# Altium schematic sheet Choin_rez1_0.SchDoc
size A4; DocumentNumber: 4; SheetNumber: 4; SheetTotal: 4; LotOfPieces: 1
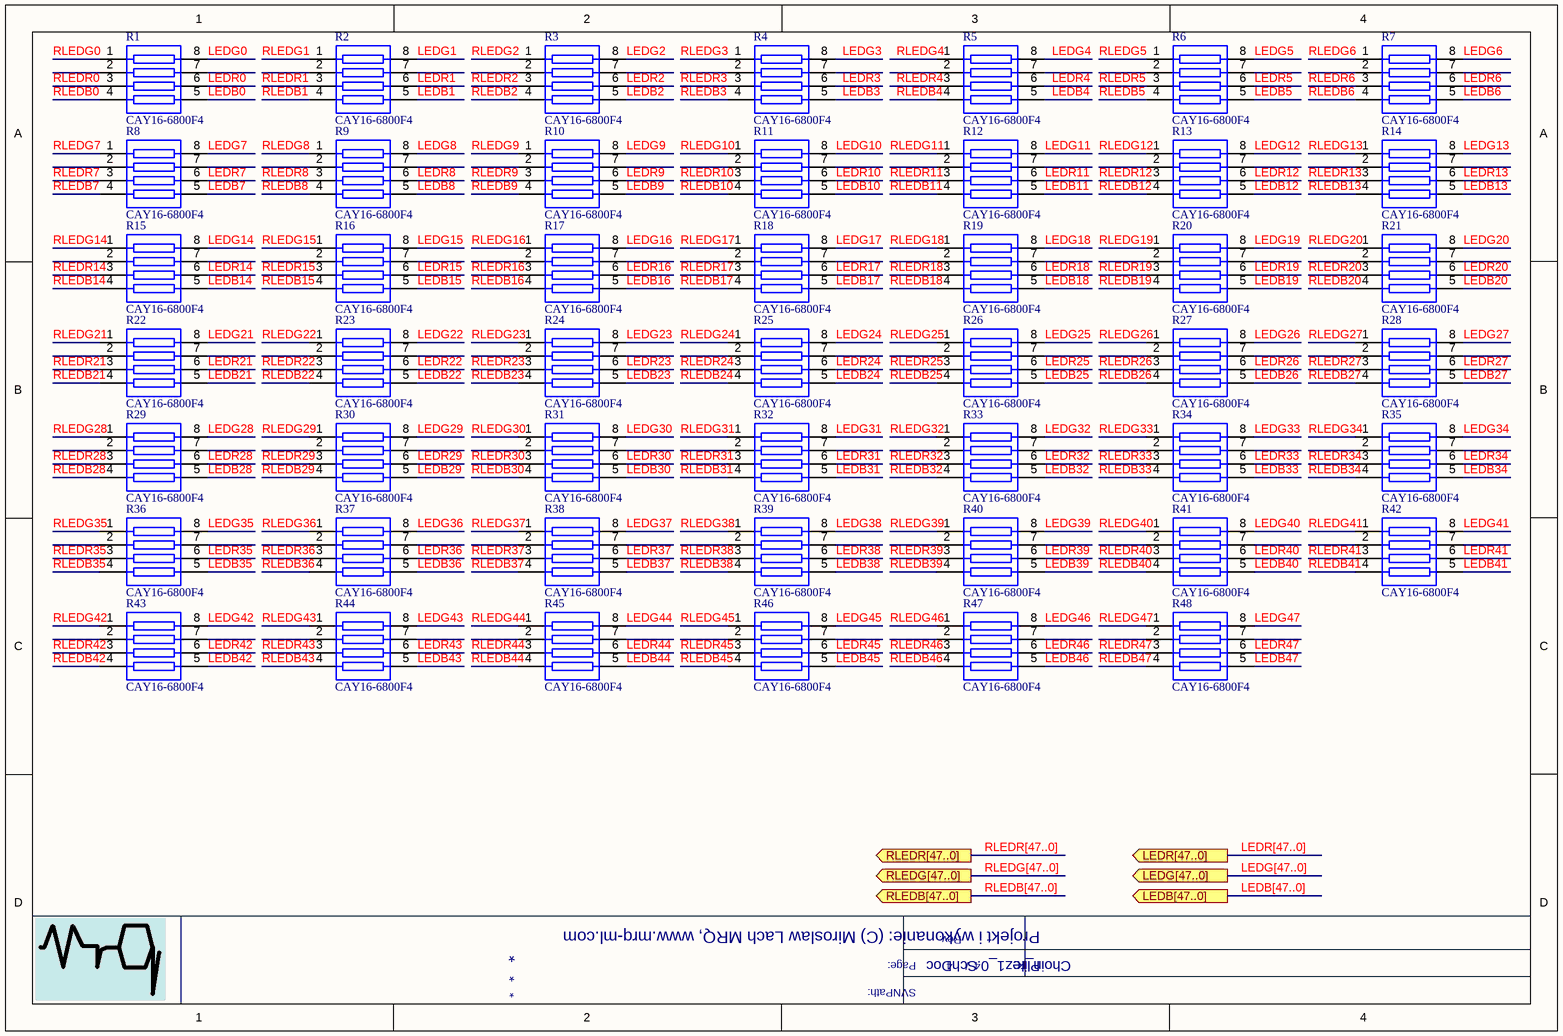
[diagram p0: Choin_rez1_0.SchDoc]

## Parts
R1  CAY16-6800F4  [1206RPS]
R2  CAY16-6800F4  [1206RPS]
R3  CAY16-6800F4  [1206RPS]
R4  CAY16-6800F4  [1206RPS]
R5  CAY16-6800F4  [1206RPS]
R6  CAY16-6800F4  [1206RPS]
R7  CAY16-6800F4  [1206RPS]
R8  CAY16-6800F4  [1206RPS]
R9  CAY16-6800F4  [1206RPS]
R10  CAY16-6800F4  [1206RPS]
R11  CAY16-6800F4  [1206RPS]
R12  CAY16-6800F4  [1206RPS]
R13  CAY16-6800F4  [1206RPS]
R14  CAY16-6800F4  [1206RPS]
R15  CAY16-6800F4  [1206RPS]
R16  CAY16-6800F4  [1206RPS]
R17  CAY16-6800F4  [1206RPS]
R18  CAY16-6800F4  [1206RPS]
R19  CAY16-6800F4  [1206RPS]
R20  CAY16-6800F4  [1206RPS]
R21  CAY16-6800F4  [1206RPS]
R22  CAY16-6800F4  [1206RPS]
R23  CAY16-6800F4  [1206RPS]
R24  CAY16-6800F4  [1206RPS]
R25  CAY16-6800F4  [1206RPS]
R26  CAY16-6800F4  [1206RPS]
R27  CAY16-6800F4  [1206RPS]
R28  CAY16-6800F4  [1206RPS]
R29  CAY16-6800F4  [1206RPS]
R30  CAY16-6800F4  [1206RPS]
R31  CAY16-6800F4  [1206RPS]
R32  CAY16-6800F4  [1206RPS]
R33  CAY16-6800F4  [1206RPS]
R34  CAY16-6800F4  [1206RPS]
R35  CAY16-6800F4  [1206RPS]
R36  CAY16-6800F4  [1206RPS]
R37  CAY16-6800F4  [1206RPS]
R38  CAY16-6800F4  [1206RPS]
R39  CAY16-6800F4  [1206RPS]
R40  CAY16-6800F4  [1206RPS]
R41  CAY16-6800F4  [1206RPS]
R42  CAY16-6800F4  [1206RPS]
R43  CAY16-6800F4  [1206RPS]
R44  CAY16-6800F4  [1206RPS]
R45  CAY16-6800F4  [1206RPS]
R46  CAY16-6800F4  [1206RPS]
R47  CAY16-6800F4  [1206RPS]
R48  CAY16-6800F4  [1206RPS]

## Ports
LEDB[47..0], LEDG[47..0], LEDR[47..0], RLEDB[47..0], RLEDG[47..0], RLEDR[47..0]

## Nets
LEDB0: R1.5(R5)
LEDB1: R2.5(R5)
LEDB2: R3.5(R5)
LEDB3: R4.5(R5)
LEDB4: R5.5(R5)
LEDB5: R6.5(R5)
LEDB6: R7.5(R5)
LEDB7: R8.5(R5)
LEDB8: R9.5(R5)
LEDB9: R10.5(R5)
LEDB10: R11.5(R5)
LEDB11: R12.5(R5)
LEDB12: R13.5(R5)
LEDB13: R14.5(R5)
LEDB14: R15.5(R5)
LEDB15: R16.5(R5)
LEDB16: R17.5(R5)
LEDB17: R18.5(R5)
LEDB18: R19.5(R5)
LEDB19: R20.5(R5)
LEDB20: R21.5(R5)
LEDB21: R22.5(R5)
LEDB22: R23.5(R5)
LEDB23: R24.5(R5)
LEDB24: R25.5(R5)
LEDB25: R26.5(R5)
LEDB26: R27.5(R5)
LEDB27: R28.5(R5)
LEDB28: R29.5(R5)
LEDB29: R30.5(R5)
LEDB30: R31.5(R5)
LEDB31: R32.5(R5)
LEDB32: R33.5(R5)
LEDB33: R34.5(R5)
LEDB34: R35.5(R5)
LEDB35: R36.5(R5)
LEDB36: R37.5(R5)
LEDB37: R38.5(R5)
LEDB38: R39.5(R5)
LEDB39: R40.5(R5)
LEDB40: R41.5(R5)
LEDB41: R42.5(R5)
LEDB42: R43.5(R5)
LEDB43: R44.5(R5)
LEDB44: R45.5(R5)
LEDB45: R46.5(R5)
LEDB46: R47.5(R5)
LEDB47: R48.5(R5)
LEDG0: R1.8(R8)
LEDG1: R2.8(R8)
LEDG2: R3.8(R8)
LEDG3: R4.8(R8)
LEDG4: R5.8(R8)
LEDG5: R6.8(R8)
LEDG6: R7.8(R8)
LEDG7: R8.8(R8)
LEDG8: R9.8(R8)
LEDG9: R10.8(R8)
LEDG10: R11.8(R8)
LEDG11: R12.8(R8)
LEDG12: R13.8(R8)
LEDG13: R14.8(R8)
LEDG14: R15.8(R8)
LEDG15: R16.8(R8)
LEDG16: R17.8(R8)
LEDG17: R18.8(R8)
LEDG18: R19.8(R8)
LEDG19: R20.8(R8)
LEDG20: R21.8(R8)
LEDG21: R22.8(R8)
LEDG22: R23.8(R8)
LEDG23: R24.8(R8)
LEDG24: R25.8(R8)
LEDG25: R26.8(R8)
LEDG26: R27.8(R8)
LEDG27: R28.8(R8)
LEDG28: R29.8(R8)
LEDG29: R30.8(R8)
LEDG30: R31.8(R8)
LEDG31: R32.8(R8)
LEDG32: R33.8(R8)
LEDG33: R34.8(R8)
LEDG34: R35.8(R8)
LEDG35: R36.8(R8)
LEDG36: R37.8(R8)
LEDG37: R38.8(R8)
LEDG38: R39.8(R8)
LEDG39: R40.8(R8)
LEDG40: R41.8(R8)
LEDG41: R42.8(R8)
LEDG42: R43.8(R8)
LEDG43: R44.8(R8)
LEDG44: R45.8(R8)
LEDG45: R46.8(R8)
LEDG46: R47.8(R8)
LEDG47: R48.8(R8)
LEDR0: R1.6(R6)
LEDR1: R2.6(R6)
LEDR2: R3.6(R6)
LEDR3: R4.6(R6)
LEDR4: R5.6(R6)
LEDR5: R6.6(R6)
LEDR6: R7.6(R6)
LEDR7: R8.6(R6)
LEDR8: R9.6(R6)
LEDR9: R10.6(R6)
LEDR10: R11.6(R6)
LEDR11: R12.6(R6)
LEDR12: R13.6(R6)
LEDR13: R14.6(R6)
LEDR14: R15.6(R6)
LEDR15: R16.6(R6)
LEDR16: R17.6(R6)
LEDR17: R18.6(R6)
LEDR18: R19.6(R6)
LEDR19: R20.6(R6)
LEDR20: R21.6(R6)
LEDR21: R22.6(R6)
LEDR22: R23.6(R6)
LEDR23: R24.6(R6)
LEDR24: R25.6(R6)
LEDR25: R26.6(R6)
LEDR26: R27.6(R6)
LEDR27: R28.6(R6)
LEDR28: R29.6(R6)
LEDR29: R30.6(R6)
LEDR30: R31.6(R6)
LEDR31: R32.6(R6)
LEDR32: R33.6(R6)
LEDR33: R34.6(R6)
LEDR34: R35.6(R6)
LEDR35: R36.6(R6)
LEDR36: R37.6(R6)
LEDR37: R38.6(R6)
LEDR38: R39.6(R6)
LEDR39: R40.6(R6)
LEDR40: R41.6(R6)
LEDR41: R42.6(R6)
LEDR42: R43.6(R6)
LEDR43: R44.6(R6)
LEDR44: R45.6(R6)
LEDR45: R46.6(R6)
LEDR46: R47.6(R6)
LEDR47: R48.6(R6)
RLEDB0: R1.4(R4)
RLEDB1: R2.4(R4)
RLEDB2: R3.4(R4)
RLEDB3: R4.4(R4)
RLEDB4: R5.4(R4)
RLEDB5: R6.4(R4)
RLEDB6: R7.4(R4)
RLEDB7: R8.4(R4)
RLEDB8: R9.4(R4)
RLEDB9: R10.4(R4)
RLEDB10: R11.4(R4)
RLEDB11: R12.4(R4)
RLEDB12: R13.4(R4)
RLEDB13: R14.4(R4)
RLEDB14: R15.4(R4)
RLEDB15: R16.4(R4)
RLEDB16: R17.4(R4)
RLEDB17: R18.4(R4)
RLEDB18: R19.4(R4)
RLEDB19: R20.4(R4)
RLEDB20: R21.4(R4)
RLEDB21: R22.4(R4)
RLEDB22: R23.4(R4)
RLEDB23: R24.4(R4)
RLEDB24: R25.4(R4)
RLEDB25: R26.4(R4)
RLEDB26: R27.4(R4)
RLEDB27: R28.4(R4)
RLEDB28: R29.4(R4)
RLEDB29: R30.4(R4)
RLEDB30: R31.4(R4)
RLEDB31: R32.4(R4)
RLEDB32: R33.4(R4)
RLEDB33: R34.4(R4)
RLEDB34: R35.4(R4)
RLEDB35: R36.4(R4)
RLEDB36: R37.4(R4)
RLEDB37: R38.4(R4)
RLEDB38: R39.4(R4)
RLEDB39: R40.4(R4)
RLEDB40: R41.4(R4)
RLEDB41: R42.4(R4)
RLEDB42: R43.4(R4)
RLEDB43: R44.4(R4)
RLEDB44: R45.4(R4)
RLEDB45: R46.4(R4)
RLEDB46: R47.4(R4)
RLEDB47: R48.4(R4)
RLEDG0: R1.1(R1)
RLEDG1: R2.1(R1)
RLEDG2: R3.1(R1)
RLEDG3: R4.1(R1)
RLEDG4: R5.1(R1)
RLEDG5: R6.1(R1)
RLEDG6: R7.1(R1)
RLEDG7: R8.1(R1)
RLEDG8: R9.1(R1)
RLEDG9: R10.1(R1)
RLEDG10: R11.1(R1)
RLEDG11: R12.1(R1)
RLEDG12: R13.1(R1)
RLEDG13: R14.1(R1)
RLEDG14: R15.1(R1)
RLEDG15: R16.1(R1)
RLEDG16: R17.1(R1)
RLEDG17: R18.1(R1)
RLEDG18: R19.1(R1)
RLEDG19: R20.1(R1)
RLEDG20: R21.1(R1)
RLEDG21: R22.1(R1)
RLEDG22: R23.1(R1)
RLEDG23: R24.1(R1)
RLEDG24: R25.1(R1)
RLEDG25: R26.1(R1)
RLEDG26: R27.1(R1)
RLEDG27: R28.1(R1)
RLEDG28: R29.1(R1)
RLEDG29: R30.1(R1)
RLEDG30: R31.1(R1)
RLEDG31: R32.1(R1)
RLEDG32: R33.1(R1)
RLEDG33: R34.1(R1)
RLEDG34: R35.1(R1)
RLEDG35: R36.1(R1)
RLEDG36: R37.1(R1)
RLEDG37: R38.1(R1)
RLEDG38: R39.1(R1)
RLEDG39: R40.1(R1)
RLEDG40: R41.1(R1)
RLEDG41: R42.1(R1)
RLEDG42: R43.1(R1)
RLEDG43: R44.1(R1)
RLEDG44: R45.1(R1)
RLEDG45: R46.1(R1)
RLEDG46: R47.1(R1)
RLEDG47: R48.1(R1)
RLEDR0: R1.3(R3)
RLEDR1: R2.3(R3)
RLEDR2: R3.3(R3)
RLEDR3: R4.3(R3)
RLEDR4: R5.3(R3)
RLEDR5: R6.3(R3)
RLEDR6: R7.3(R3)
RLEDR7: R8.3(R3)
RLEDR8: R9.3(R3)
RLEDR9: R10.3(R3)
RLEDR10: R11.3(R3)
RLEDR11: R12.3(R3)
RLEDR12: R13.3(R3)
RLEDR13: R14.3(R3)
RLEDR14: R15.3(R3)
RLEDR15: R16.3(R3)
RLEDR16: R17.3(R3)
RLEDR17: R18.3(R3)
RLEDR18: R19.3(R3)
RLEDR19: R20.3(R3)
RLEDR20: R21.3(R3)
RLEDR21: R22.3(R3)
RLEDR22: R23.3(R3)
RLEDR23: R24.3(R3)
RLEDR24: R25.3(R3)
RLEDR25: R26.3(R3)
RLEDR26: R27.3(R3)
RLEDR27: R28.3(R3)
RLEDR28: R29.3(R3)
RLEDR29: R30.3(R3)
RLEDR30: R31.3(R3)
RLEDR31: R32.3(R3)
RLEDR32: R33.3(R3)
RLEDR33: R34.3(R3)
RLEDR34: R35.3(R3)
RLEDR35: R36.3(R3)
RLEDR36: R37.3(R3)
RLEDR37: R38.3(R3)
RLEDR38: R39.3(R3)
RLEDR39: R40.3(R3)
RLEDR40: R41.3(R3)
RLEDR41: R42.3(R3)
RLEDR42: R43.3(R3)
RLEDR43: R44.3(R3)
RLEDR44: R45.3(R3)
RLEDR45: R46.3(R3)
RLEDR46: R47.3(R3)
RLEDR47: R48.3(R3)

Not connected (* = marked no-connect by the designer): R1 2(R2) 7(R7); R2 2(R2) 7(R7); R3 2(R2) 7(R7); R4 2(R2) 7(R7); R5 2(R2) 7(R7); R6 2(R2) 7(R7); R7 2(R2) 7(R7); R8 2(R2) 7(R7); R9 2(R2) 7(R7); R10 2(R2) 7(R7); R11 2(R2) 7(R7); R12 2(R2) 7(R7); R13 2(R2) 7(R7); R14 2(R2) 7(R7); R15 2(R2) 7(R7); R16 2(R2) 7(R7); R17 2(R2) 7(R7); R18 2(R2) 7(R7); R19 2(R2) 7(R7); R20 2(R2) 7(R7); R21 2(R2) 7(R7); R22 2(R2) 7(R7); R23 2(R2) 7(R7); R24 2(R2) 7(R7); R25 2(R2) 7(R7); R26 2(R2) 7(R7); R27 2(R2) 7(R7); R28 2(R2) 7(R7); R29 2(R2) 7(R7); R30 2(R2) 7(R7); R31 2(R2) 7(R7); R32 2(R2) 7(R7); R33 2(R2) 7(R7); R34 2(R2) 7(R7); R35 2(R2) 7(R7); R36 2(R2) 7(R7); R37 2(R2) 7(R7); R38 2(R2) 7(R7); R39 2(R2) 7(R7); R40 2(R2) 7(R7); R41 2(R2) 7(R7); R42 2(R2) 7(R7); R43 2(R2) 7(R7); R44 2(R2) 7(R7); R45 2(R2) 7(R7); R46 2(R2) 7(R7); R47 2(R2) 7(R7); R48 2(R2) 7(R7)

## Buses and harness runs
bus LEDB[47..0] = port LEDB[47..0]
bus LEDG[47..0] = port LEDG[47..0]
bus LEDR[47..0] = port LEDR[47..0]
bus RLEDB[47..0] = port RLEDB[47..0]
bus RLEDG[47..0] = port RLEDG[47..0]
bus RLEDR[47..0] = port RLEDR[47..0]

## Notes on the sheet
- Projekt i wykonanie: (C) Miroslaw Lach MRQ, www.mrq-ml.com
- SVNPath:
- Page:
- Rev.
- /
- Plik:

## Library data of the parts
R1-R48 = CAY16-6800F4[[/\]]1206RP[[/\]]0.063W[[/\]]1%[[/\]]4x680R 1%: DissPower: 0.063W; Tolerance: 1%; Descript: resistor network 4x680R 1%, 1206; Typ5: CAY16-6800F4LF; Currency5: PLN; Amount5: 1+; Value: CAY16-6800F4; OtherParams: 4x680R 1%; Dimensions: 1206RP; Supplier5: tme.pl; Reference5: CAY16-6800F4; Manufacturer5: Bourns; Price5: 0,0279; DateOfPrice5: 2013-12-28